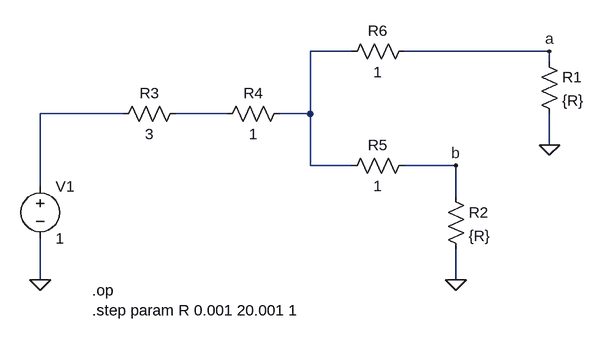
[diagram p0: schematic CH03-KP6-06.asc]
CH03-KP6-06.asc, the LTspice schematic file:
Version 4
SHEET 1 880 680
WIRE 336 208 272 208
WIRE 640 208 416 208
WIRE 640 224 640 208
WIRE -16 304 -144 304
WIRE 144 304 64 304
WIRE 272 304 272 208
WIRE 272 304 224 304
WIRE 640 352 640 304
WIRE 272 384 272 304
WIRE 336 384 272 384
WIRE 496 384 416 384
WIRE -144 416 -144 304
WIRE 496 432 496 384
WIRE -144 560 -144 496
WIRE 496 560 496 512
FLAG 496 560 0
FLAG 640 352 0
FLAG -144 560 0
FLAG 640 208 a
FLAG 496 384 b
SYMBOL res 624 208 R0
SYMATTR InstName R1
SYMATTR Value {R}
SYMBOL res 480 416 R0
SYMATTR InstName R2
SYMATTR Value {R}
SYMBOL res 80 288 R90
WINDOW 0 0 56 VBottom 2
WINDOW 3 32 56 VTop 2
SYMATTR InstName R3
SYMATTR Value 3
SYMBOL res 240 288 R90
WINDOW 0 0 56 VBottom 2
WINDOW 3 32 56 VTop 2
SYMATTR InstName R4
SYMATTR Value 1
SYMBOL res 432 368 R90
WINDOW 0 0 56 VBottom 2
WINDOW 3 32 56 VTop 2
SYMATTR InstName R5
SYMATTR Value 1
SYMBOL res 432 192 R90
WINDOW 0 0 56 VBottom 2
WINDOW 3 32 56 VTop 2
SYMATTR InstName R6
SYMATTR Value 1
SYMBOL voltage -144 400 R0
SYMATTR InstName V1
SYMATTR Value 1
TEXT -64 576 Left 2 !.op\n.step param R 0.001 20.001 1

The netlist it stands for:
* CH03-KP6-06.asc
R1 a 0 {R}
R2 b 0 {R}
R3 N003 N002 3
R4 N001 N003 1
R5 b N001 1
R6 a N001 1
V1 N002 0 1
.op
.step param R 0.001 20.001 1
.backanno
.end